# Altium project A3000_8MB.PrjPcb
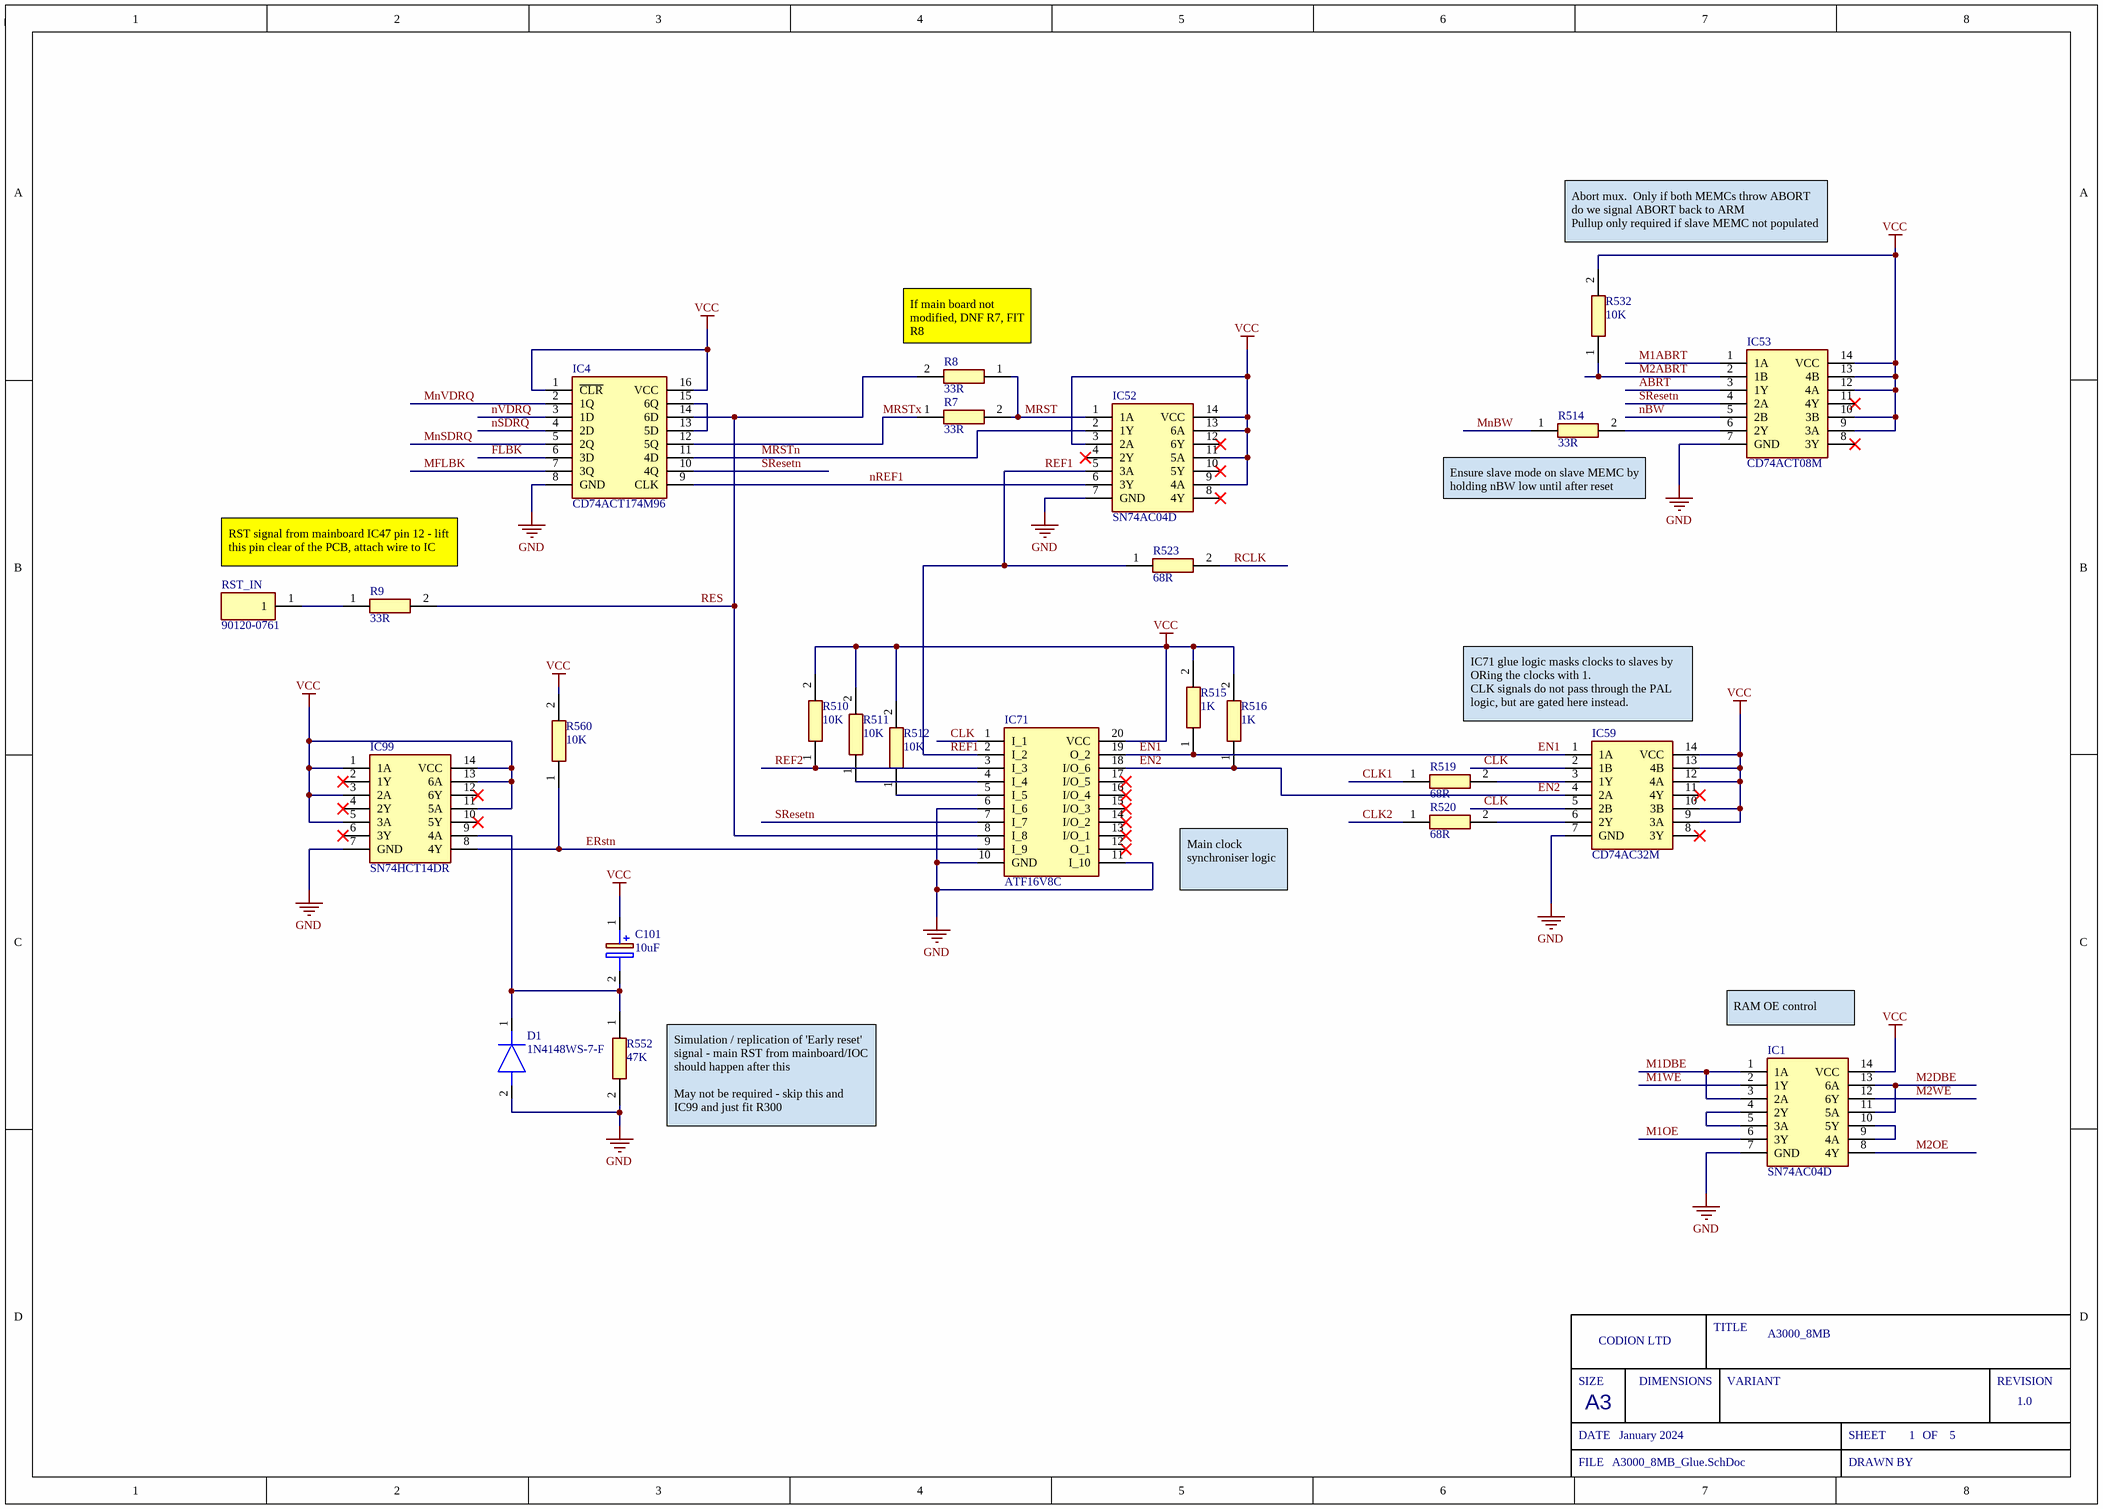
[diagram p0: A3000_8MB_Glue.SchDoc]
BOM_RevNo: 1.0; Engineer_Name: Codion Ltd; PCB_RevNo: 1.2; Project_Title: A3000_8MB; ProjectName: A3000_8MB; Sch_releaseDate: January 2024; Sch_RevNo: 1.0
3 sheets, 83 parts. Net scope: global (net labels, ports and power ports of the same name join across sheets).
Board file: A3000_8MB.pcbdoc
Sheets:
  A3000_8MB_Glue.SchDoc
  A3000_8MB.SchDoc
  A3000_8MB_Slave.SchDoc

## Sheet A3000_8MB_Glue.SchDoc
size A3; DocumentNumber: 1; SheetNumber: 1; SheetTotal: 5

### Parts
C101  10uF  [EEE0GA101SR]
D1  1N4148WS-7-F  [SOD2513X120N]
IC1  SN74AC04D  [SOIC127P600X175-14N]
IC4  CD74ACT174M96  [SOIC127P600X175-16N]
IC52  SN74AC04D  [SOIC127P600X175-14N]
IC53  CD74ACT08M  [SOIC127P600X175-14N]
IC59  CD74AC32M  [SOIC127P600X175-14N]
IC71  ATF16V8C  [DIP762W66P254L2692H508Q20N]
IC99  SN74HCT14DR  [SOIC127P600X175-14N]
R7  33R  [RESC1005X40N]
R8  33R  [RESC1005X40N]
R9  33R  [RESC1005X40N]
R510  10K  [RESC1005X40N]
R511  10K  [RESC1005X40N]
R512  10K  [RESC1005X40N]
R514  33R  [RESC1005X40N]
R515  1K  [RESC1005X40N]
R516  1K  [RESC1005X40N]
R519  68R  [RESC1005X40N]
R520  68R  [RESC1005X40N]
R523  68R  [RESC1005X40N]
R532  10K  [RESC1005X40N]
R552  47K  [RESC1005X40N]
R560  10K  [RESC1005X40N]
RST_IN  90120-0761  [HDRV1W90P0X254_1X1_232X249X560P]

### Nets
GND: D1.2(A) IC1.7(GND) IC4.8(GND) IC52.7(GND) IC53.7(GND) IC59.7(GND) IC71.6(I_6) IC71.10(GND) IC71.11(I_10) IC99.7(GND) R552.2
VCC: C101.1(+) IC1.14(VCC) IC4.1(~{CLR}) IC4.16(VCC) IC52.3(2A) IC52.9(4A) IC52.11(5A) IC52.13(6A) IC52.14(VCC) IC53.9(3A) IC53.10(3B) IC53.12(4A) IC53.13(4B) IC53.14(VCC) IC59.9(3A) IC59.10(3B) IC59.12(4A) IC59.13(4B) IC59.14(VCC) IC71.20(VCC) IC99.1(1A) IC99.3(2A) IC99.5(3A) IC99.11(5A) IC99.13(6A) IC99.14(VCC) R510.2 R511.2 R512.2 R515.2 R516.2 R532.2 R560.2
ABRT: IC53.3(1Y)
CLK: IC59.2(1B) IC59.5(2B) IC71.1(I_1)
CLK1: R519.1
CLK2: R520.1
EN1: IC59.1(1A) IC71.19(O_2) R515.1
EN2: IC59.4(2A) IC71.18(I/O_6) R516.1
ERstn: IC71.9(I_9) IC99.8(4Y) R560.1
FLBK: IC4.6(3D)
M1ABRT: IC53.1(1A)
M1DBE: IC1.1(1A) IC1.3(2A)
M1OE: IC1.6(3Y)
M1WE: IC1.2(1Y)
M2ABRT: IC53.2(1B) R532.1
M2DBE: IC1.11(5A) IC1.13(6A)
M2OE: IC1.8(4Y)
M2WE: IC1.12(6Y)
MFLBK: IC4.7(3Q)
MnBW: R514.1
MnSDRQ: IC4.5(2Q)
MnVDRQ: IC4.2(1Q)
MRST: IC52.1(1A) R7.2 R8.1
MRSTn: IC4.11(4D) IC52.2(1Y)
MRSTx: IC4.12(5Q) R7.1
nBW: IC53.5(2B)
nREF1: IC4.9(CLK) IC52.6(3Y)
nSDRQ: IC4.4(2D)
nVDRQ: IC4.3(1D)
RCLK: R523.2
REF1: IC52.5(3A) IC71.2(I_2) R523.1
REF2: IC71.3(I_3) R510.1
RES: IC4.14(6D) IC71.8(I_8) R8.2 R9.2
SResetn: IC4.10(4Q) IC53.4(2A) IC71.7(I_7)
NetC101_2: C101.2(-) D1.1(K) IC99.9(4A) R552.1
NetIC1_4: IC1.4(2Y) IC1.5(3A)
NetIC1_9: IC1.9(4A) IC1.10(5Y)
NetIC4_13: IC4.13(5D) IC4.15(6Q)
NetIC53_6: IC53.6(2Y) R514.2
NetIC59_3: IC59.3(1Y) R519.2
NetIC59_6: IC59.6(2Y) R520.2
NetIC71_4: IC71.4(I_4) R511.1
NetIC71_5: IC71.5(I_5) R512.1
NetR9_1: R9.1 RST_IN.1

Not connected (* = marked no-connect by the designer): IC52 4(2Y)* 8(4Y)* 10(5Y)* 12(6Y)*; IC53 8(3Y)* 11(4Y)*; IC59 8(3Y)* 11(4Y)*; IC71 12(O_1)* 13(I/O_1)* 14(I/O_2)* 15(I/O_3)* 16(I/O_4)* 17(I/O_5)*; IC99 2(1Y)* 4(2Y)* 6(3Y)* 10(5Y)* 12(6Y)*

### Notes on the sheet
- Abort mux.  Only if both MEMCs throw ABORT do we signal ABORT back to ARM
  Pullup only required if slave MEMC not populated
- (near R8) If main board not modified, DNF R7, FIT R8
- (near R514) Ensure slave mode on slave MEMC by holding nBW low until after reset
- RST signal from mainboard IC47 pin 12 - lift this pin clear of the PCB, attach wire to IC
- (near IC59) IC71 glue logic masks clocks to slaves by ORing the clocks with 1.
  CLK signals do not pass through the PAL logic, but are gated here instead.
- Main clock synchroniser logic
- (near IC1) RAM OE control
- Simulation / replication of 'Early reset' signal - main RST from mainboard/IOC should happen after this
  May not be required - skip this and IC99 and just fit R300
- SIZE
- CODION LTD
- DIMENSIONS
- TITLE
- VARIANT
- REVISION
- DATE
- A3
- SHEET
- OF
- FILE
- DRAWN BY

### Library data of the parts
C101 = EEE-1EA100SR: Capacitor Polarised; Manufacturer_Name: Panasonic; Datasheet Link: http://industrial.panasonic.com/cdbs/www-data/pdf/RDE0000/ABA0000C1145.pdf; Height: 6.5mm; Manufacturer_Part_Number: EEE-1EA100SR; Mouser Part Number: 667-EEE-1EA100SR; Mouser Price/Stock: https://www.mouser.co.uk/ProductDetail/Panasonic/EEE-1EA100SR?qs=ANJC8C65Mw4%2Fvo1GoepKcQ%3D%3D; Arrow Part Number: EEE-1EA100SR; Arrow Price/Stock: https://www.arrow.com/en/products/eee-1ea100sr/panasonic?region=nac
D1 = 1N4148WS-7-F: Diode; Manufacturer_Name: Diodes Inc.; Datasheet Link: https://componentsearchengine.com/Datasheets/2/1N4148WS-7-F.pdf; Height: 1.2mm; Manufacturer_Part_Number: 1N4148WS-7-F; Mouser Part Number: 621-1N4148WS-F; Mouser Price/Stock: https://www.mouser.co.uk/ProductDetail/Diodes-Incorporated/1N4148WS-7-F?qs=4drIV0IxA0r8aNy7%2Fu4kVw%3D%3D; Arrow Part Number: 1N4148WS-7-F; Arrow Price/Stock: https://www.arrow.com/en/products/1n4148ws-7-f/diodes-incorporated?region=asia; LCSC Part #: C2128
IC1 IC52 = SN74AC04D: Integrated Circuit; Manufacturer_Name: Texas Instruments; Datasheet Link: http://www.ti.com/lit/ds/symlink/sn74ac04.pdf; Height: 1.75mm; Manufacturer_Part_Number: SN74AC04D; Mouser Part Number: 595-SN74AC04D; Mouser Price/Stock: https://www.mouser.co.uk/ProductDetail/Texas-Instruments/SN74AC04D?qs=w32V8uFkMxkvsyMHHacuZw%3D%3D; Arrow Part Number: SN74AC04D; Arrow Price/Stock: https://www.arrow.com/en/products/sn74ac04d/texas-instruments?region=nac; LCSC Part #: C352940
IC4 = CD74ACT174M96: Integrated Circuit; Manufacturer_Name: Texas Instruments; Datasheet Link: http://www.ti.com/lit/gpn/cd74act174; Height: 1.75mm; Manufacturer_Part_Number: CD74ACT174M96; Mouser Part Number: 595-CD74ACT174M96; Mouser Price/Stock: https://www.mouser.co.uk/ProductDetail/Texas-Instruments/CD74ACT174M96?qs=w32V8uFkMxkDXs1ka6HDkg%3D%3D
IC53 = CD74ACT08M: Integrated Circuit; Manufacturer_Name: Texas Instruments; Datasheet Link: http://www.ti.com/lit/ds/symlink/cd74act08.pdf; Height: 1.75mm; Manufacturer_Part_Number: CD74ACT08M; Mouser Part Number: 595-CD74ACT08M; Mouser Price/Stock: https://www.mouser.co.uk/ProductDetail/Texas-Instruments/CD74ACT08M?qs=Dqy2GfToSoQdsNWXM2phYA%3D%3D; LCSC Part #: C233452
IC59 = CD74AC32M: Integrated Circuit; Manufacturer_Name: Texas Instruments; Datasheet Link: http://www.ti.com/lit/ds/symlink/cd74ac32.pdf; Height: 1.75mm; Manufacturer_Part_Number: CD74AC32M; Mouser Part Number: 595-CD74AC32M; Mouser Price/Stock: https://www.mouser.co.uk/ProductDetail/Texas-Instruments/CD74AC32M?qs=OorDGPQ79Eqsy7tzrsTtUg%3D%3D; Arrow Part Number: CD74AC32M; Arrow Price/Stock: https://www.arrow.com/en/products/cd74ac32m/texas-instruments; LCSC Part #: C352943
IC71 = PAL16R4AMJ: Integrated Circuit; Manufacturer_Name: Texas Instruments; Datasheet Link: http://www.ti.com/lit/ds/symlink/pal16r4am.pdf; Height: 5.08mm; Manufacturer_Part_Number: PAL16R4AMJ; Mouser Part Number: 595-PAL16R4AMJ; Mouser Price/Stock: https://www.mouser.com/Search/Refine.aspx?Keyword=595-PAL16R4AMJ
IC99 = SN74HCT14DR: Integrated Circuit; Manufacturer_Name: Texas Instruments; Datasheet Link: http://www.ti.com/lit/ds/symlink/sn74hct14.pdf; Height: 1.75mm; Manufacturer_Part_Number: SN74HCT14DR; Mouser Part Number: 595-SN74HCT14DR; Mouser Price/Stock: https://www.mouser.co.uk/ProductDetail/Texas-Instruments/SN74HCT14DR?qs=SL3LIuy2dWxogEVGE105Iw%3D%3D; Arrow Part Number: SN74HCT14DR; Arrow Price/Stock: https://www.arrow.com/en/products/sn74hct14dr/texas-instruments?region=nac; LCSC Part #: C6769
R7-R9 R514 = CRCW040233R0FKED: Resistor; Manufacturer_Name: Vishay; Datasheet Link: http://www.vishay.com/docs/20035/dcrcwe3.pdf; Height: 0.4mm; Manufacturer_Part_Number: CRCW040233R0FKED; Mouser Part Number: 71-CRCW0402-33-E3; Mouser Price/Stock: https://www.mouser.co.uk/ProductDetail/Vishay-Dale/CRCW040233R0FKED?qs=TNtMkGKFKOyo77UGFlXIJw%3D%3D; Arrow Part Number: CRCW040233R0FKED; Arrow Price/Stock: https://www.arrow.com/en/products/crcw040233r0fked/vishay; LCSC Part #: C137880
R510-R512 R532 R560 = CRCW040210K0FKEDHP: Resistor; Manufacturer_Name: Vishay; Datasheet Link: http://www.vishay.com/docs/20035/dcrcwe3.pdf; Height: 0.4mm; Manufacturer_Part_Number: CRCW040210K0FKEDHP; Mouser Part Number: 71-CRCW040210K0FKEDH; Mouser Price/Stock: https://www.mouser.co.uk/ProductDetail/Vishay-Dale/CRCW040210K0FKEDHP?qs=FlFvgi4rxBxmIiaeyFjrkA%3D%3D; Arrow Part Number: CRCW040210K0FKEDHP; Arrow Price/Stock: https://www.arrow.com/en/products/crcw040210k0fkedhp/vishay?region=nac; LCSC Part #: C71617
R515 R516 = CRCW04021K00JNED: Resistor; Manufacturer_Name: Vishay; Datasheet Link: http://www.vishay.com/docs/20035/dcrcwe3.pdf; Height: 0.4mm; Manufacturer_Part_Number: CRCW04021K00JNED; Mouser Part Number: 71-CRCW0402J-1.0K-E3; Mouser Price/Stock: https://www.mouser.co.uk/ProductDetail/Vishay-Dale/CRCW04021K00JNED?qs=YX%252BK5oaHNYpGRsHVuzxl1A%3D%3D; Arrow Part Number: CRCW04021K00JNED; Arrow Price/Stock: https://www.arrow.com/en/products/crcw04021k00jned/vishay; LCSC Part #: C279981
R519 R520 R523 = CRCW040268R0FKEDHP: Resistor; Manufacturer_Name: Vishay; Datasheet Link: http://www.vishay.com/docs/20035/dcrcwe3.pdf; Height: 0.4mm; Manufacturer_Part_Number: CRCW040268R0FKEDHP; Mouser Part Number: 71-CRCW040268R0FKEDH; Mouser Price/Stock: https://www.mouser.co.uk/ProductDetail/Vishay-Dale/CRCW040268R0FKEDHP?qs=YaA%252B3EhhSt26vU44iyW%252BOw%3D%3D; Arrow Part Number: CRCW040268R0FKEDHP; Arrow Price/Stock: https://www.arrow.com/en/products/crcw040268r0fkedhp/vishay; LCSC Part #: C163455
R552 = CRCW040247K0FKED: Resistor; Manufacturer_Name: Vishay; Datasheet Link: http://www.vishay.com/docs/20035/dcrcwe3.pdf; Height: 0.4mm; Manufacturer_Part_Number: CRCW040247K0FKED; Mouser Part Number: 71-CRCW0402-47K-E3; Mouser Price/Stock: https://www.mouser.co.uk/ProductDetail/Vishay-Dale/CRCW040247K0FKED?qs=rzhQWu8UUS0SPbmGf0DOIg%3D%3D; Arrow Part Number: CRCW040247K0FKED; Arrow Price/Stock: https://www.arrow.com/en/products/crcw040247k0fked/vishay; LCSC Part #: C163440
RST_IN = 90120-0761: Connector; Manufacturer_Name: Molex; Datasheet Link: https://www.molex.com/pdm_docs/sd/901200761_sd.pdf; Height: 5.6mm; Manufacturer_Part_Number: 90120-0761; Mouser Part Number: 538-90120-0761; Mouser Price/Stock: https://www.mouser.co.uk/ProductDetail/Molex/90120-0761?qs=PvP5v7Eimsn%2F58TpDaAAow%3D%3D

## Sheet A3000_8MB.SchDoc: ARM2 to ARM3 Adapter
size A3; DocumentNumber: 1; SheetNumber: 2; SheetTotal: 5
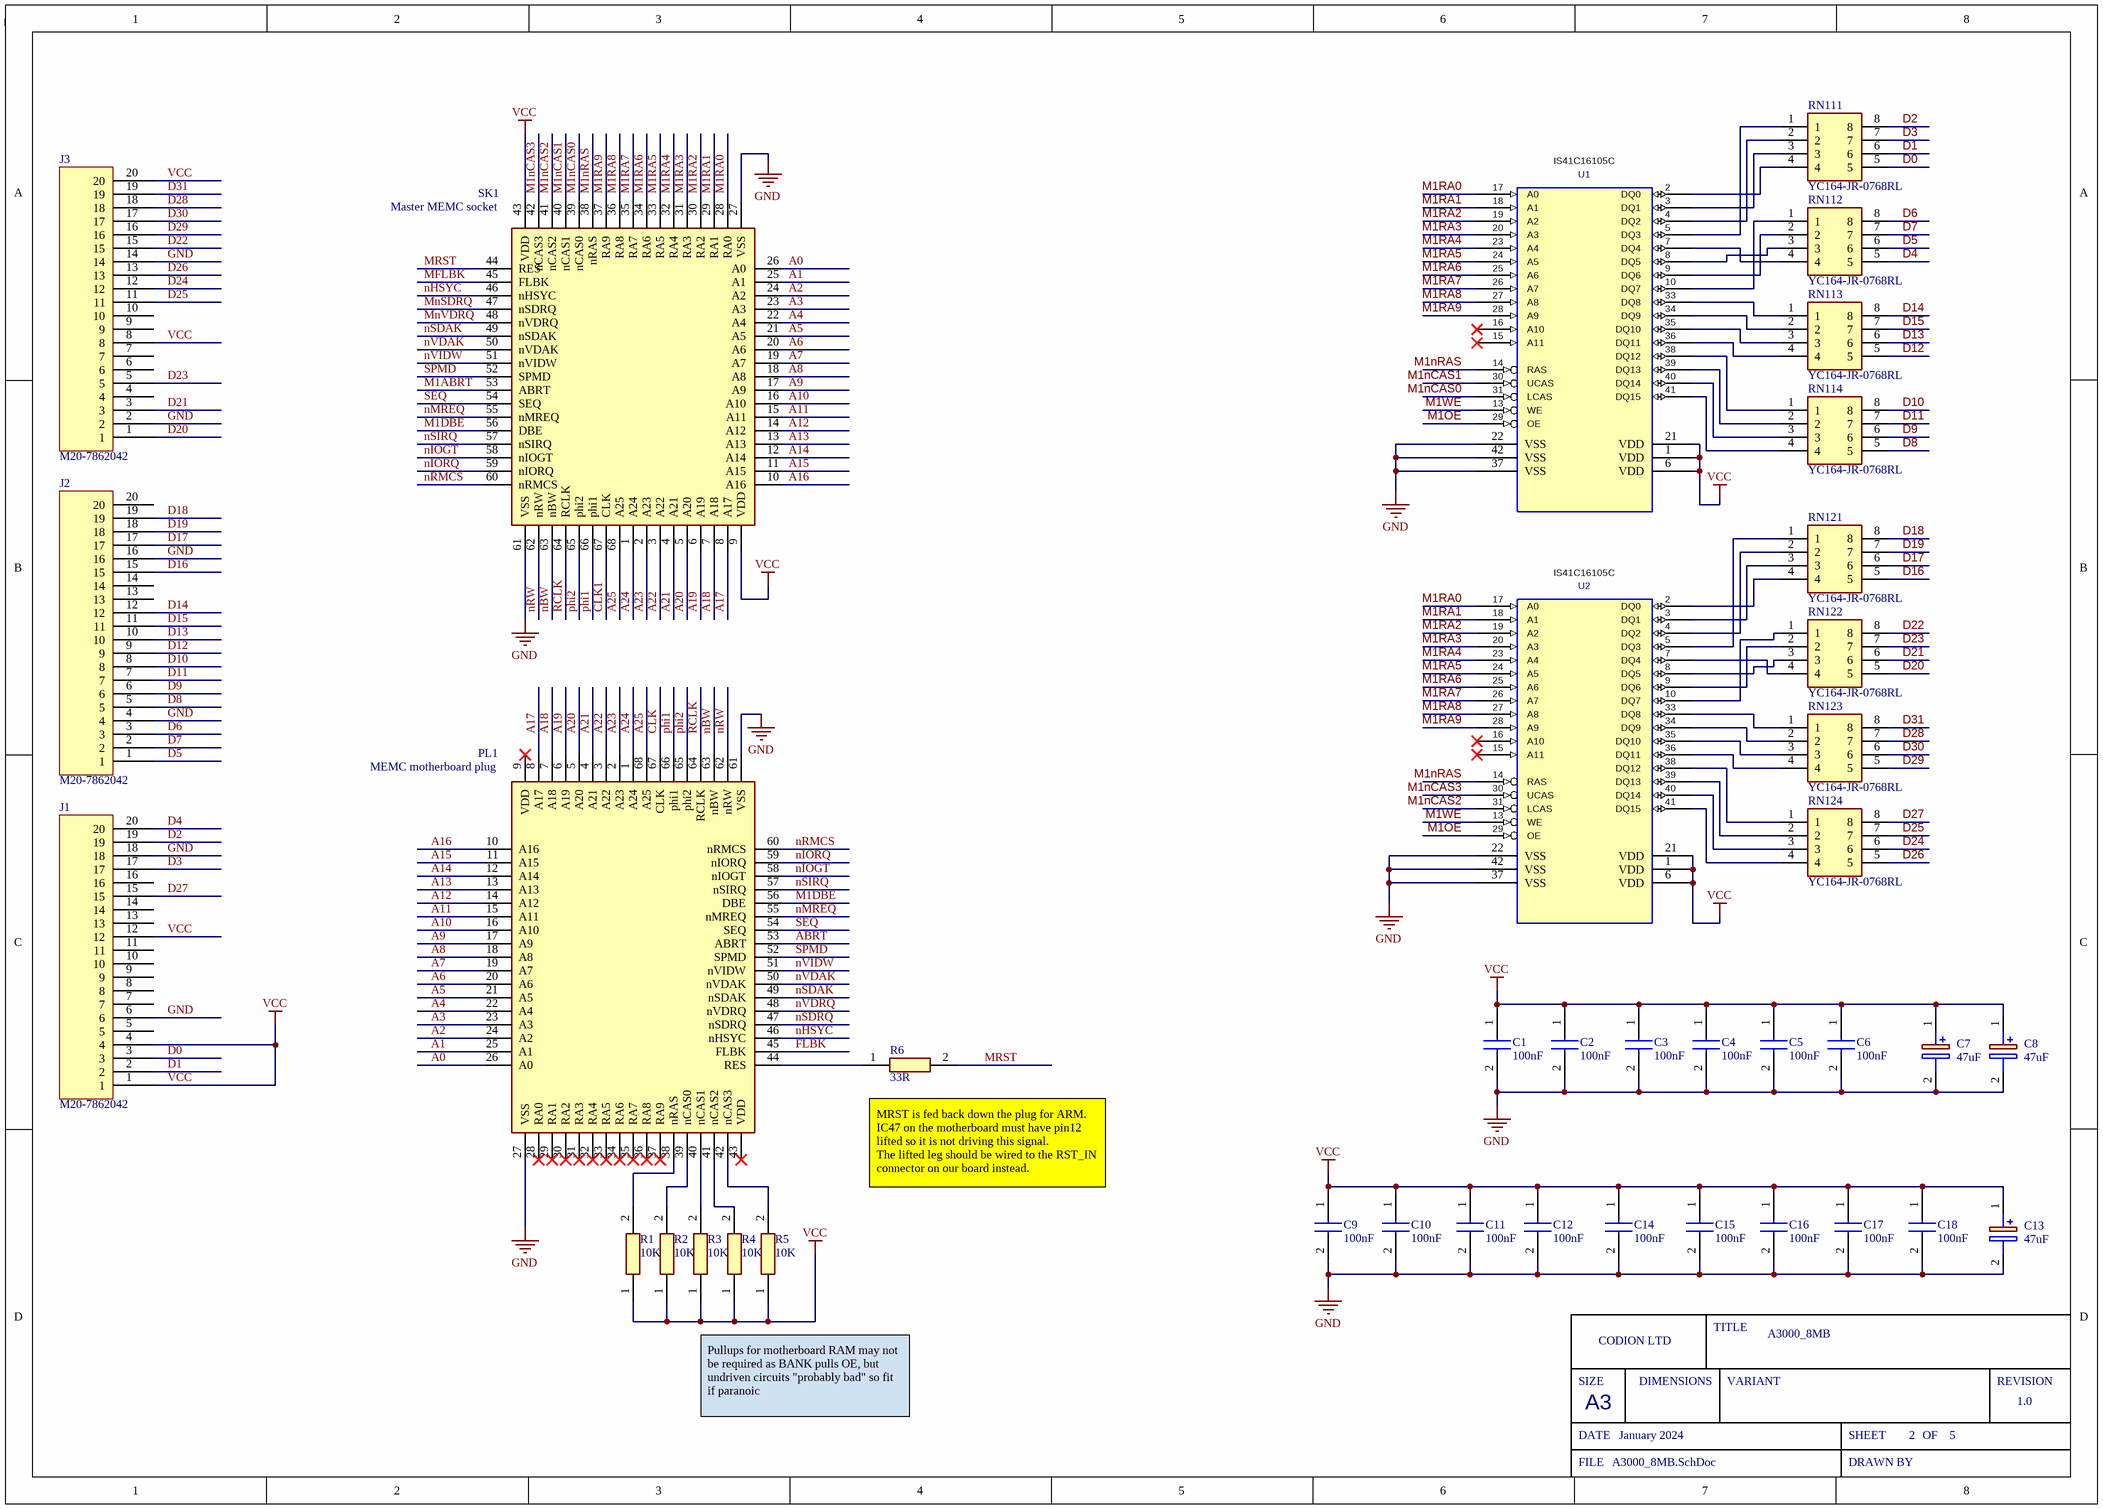
[diagram p1: A3000_8MB.SchDoc]

### Parts
C1  100nF  [0805cap]
C2  100nF  [0805cap]
C3  100nF  [0805cap]
C4  100nF  [0805cap]
C5  100nF  [0805cap]
C6  100nF  [0805cap]
C7  47uF  [EEE1AA101SP]
C8  47uF  [EEE1AA101SP]
C9  100nF  [0805cap]
C10  100nF  [0805cap]
C11  100nF  [0805cap]
C12  100nF  [0805cap]
C13  47uF  [EEE1AA101SP]
C14  100nF  [0805cap]
C15  100nF  [0805cap]
C16  100nF  [0805cap]
C17  100nF  [0805cap]
C18  100nF  [0805cap]
J1  M20-7862042  [M207862042]
J2  M20-7862042  [M207862042]
J3  M20-7862042  [M207862042]
PL1  MEMC motherboard plug  [MEMC_Plug]
R1  10K  [RESC1005X40N]
R2  10K  [RESC1005X40N]
R3  10K  [RESC1005X40N]
R4  10K  [RESC1005X40N]
R5  10K  [RESC1005X40N]
R6  33R  [RESC1005X40N]
RN111  YC164-JR-0768RL  [YC164JR0768RL]
RN112  YC164-JR-0768RL  [YC164JR0768RL]
RN113  YC164-JR-0768RL  [YC164JR0768RL]
RN114  YC164-JR-0768RL  [YC164JR0768RL]
RN121  YC164-JR-0768RL  [YC164JR0768RL]
RN122  YC164-JR-0768RL  [YC164JR0768RL]
RN123  YC164-JR-0768RL  [YC164JR0768RL]
RN124  YC164-JR-0768RL  [YC164JR0768RL]
SK1  Master MEMC socket  [MEMC_Socket]
U1  IS41C16105C  [SOJ-42]
U2  IS41C16105C  [SOJ-42]

### Nets
GND: C1.2 C2.2 C3.2 C4.2 C5.2 C6.2 C7.2(-) C8.2(-) C9.2 C10.2 C11.2 C12.2 C13.2(-) C14.2 C15.2 C16.2 C17.2 C18.2 J1.6 J1.18 J2.4 J2.16 J3.2 J3.14 PL1.27(VSS) PL1.61(VSS) SK1.27(VSS) SK1.61(VSS) U1.22(VSS) U1.37(VSS) U1.42(VSS) U2.22(VSS) U2.37(VSS) U2.42(VSS)
VCC: C1.1 C2.1 C3.1 C4.1 C5.1 C6.1 C7.1(+) C8.1(+) C9.1 C10.1 C11.1 C12.1 C13.1(+) C14.1 C15.1 C16.1 C17.1 C18.1 J1.1 J1.4 J1.12 J3.8 J3.20 R1.1 R2.1 R3.1 R4.1 R5.1 SK1.9(VDD) SK1.43(VDD) U1.1(VCC) U1.6(VCC) U1.21(VCC) U2.1(VCC) U2.6(VCC) U2.21(VCC)
A0: PL1.26(A0) SK1.26(A0)
A1: PL1.25(A1) SK1.25(A1)
A2: PL1.24(A2) SK1.24(A2)
A3: PL1.23(A3) SK1.23(A3)
A4: PL1.22(A4) SK1.22(A4)
A5: PL1.21(A5) SK1.21(A5)
A6: PL1.20(A6) SK1.20(A6)
A7: PL1.19(A7) SK1.19(A7)
A8: PL1.18(A8) SK1.18(A8)
A9: PL1.17(A9) SK1.17(A9)
A10: PL1.16(A10) SK1.16(A10)
A11: PL1.15(A11) SK1.15(A11)
A12: PL1.14(A12) SK1.14(A12)
A13: PL1.13(A13) SK1.13(A13)
A14: PL1.12(A14) SK1.12(A14)
A15: PL1.11(A15) SK1.11(A15)
A16: PL1.10(A16) SK1.10(A16)
A17: PL1.8(A17) SK1.8(A17)
A18: PL1.7(A18) SK1.7(A18)
A19: PL1.6(A19) SK1.6(A19)
A20: PL1.5(A20) SK1.5(A20)
A21: PL1.4(A21) SK1.4(A21)
A22: PL1.3(A22) SK1.3(A22)
A23: PL1.2(A23) SK1.2(A23)
A24: PL1.1(A24) SK1.1(A24)
A25: PL1.68(A25) SK1.68(A25)
ABRT: PL1.53(ABRT)
CLK: PL1.67(CLK)
CLK1: SK1.67(CLK)
D0: J1.3 RN111.5
D1: J1.2 RN111.6
D2: J1.19 RN111.8
D3: J1.17 RN111.7
D4: J1.20 RN112.5
D5: J2.1 RN112.6
D6: J2.3 RN112.8
D7: J2.2 RN112.7
D8: J2.5 RN114.5
D9: J2.6 RN114.6
D10: J2.8 RN114.8
D11: J2.7 RN114.7
D12: J2.9 RN113.5
D13: J2.10 RN113.6
D14: J2.12 RN113.8
D15: J2.11 RN113.7
D16: J2.15 RN121.5
D17: J2.17 RN121.6
D18: J2.19 RN121.8
D19: J2.18 RN121.7
D20: J3.1 RN122.5
D21: J3.3 RN122.6
D22: J3.15 RN122.8
D23: J3.5 RN122.7
D24: J3.12 RN124.6
D25: J3.11 RN124.7
D26: J3.13 RN124.5
D27: J1.15 RN124.8
D28: J3.18 RN123.7
D29: J3.16 RN123.5
D30: J3.17 RN123.6
D31: J3.19 RN123.8
FLBK: PL1.45(FLBK)
M1ABRT: SK1.53(ABRT)
M1DBE: PL1.56(DBE) SK1.56(DBE)
M1nCAS0: SK1.39(nCAS0) U1.31(LCAS)
M1nCAS1: SK1.40(nCAS1) U1.30(UCAS)
M1nCAS2: SK1.41(nCAS2) U2.31(LCAS)
M1nCAS3: SK1.42(nCAS3) U2.30(UCAS)
M1nRAS: SK1.38(nRAS) U1.14(RAS) U2.14(RAS)
M1OE: U1.29(OE) U2.29(OE)
M1RA0: SK1.28(RA0) U1.17(A0) U2.17(A0)
M1RA1: SK1.29(RA1) U1.18(A1) U2.18(A1)
M1RA2: SK1.30(RA2) U1.19(A2) U2.19(A2)
M1RA3: SK1.31(RA3) U1.20(A3) U2.20(A3)
M1RA4: SK1.32(RA4) U1.23(A4) U2.23(A4)
M1RA5: SK1.33(RA5) U1.24(A5) U2.24(A5)
M1RA6: SK1.34(RA6) U1.25(A6) U2.25(A6)
M1RA7: SK1.35(RA7) U1.26(A7) U2.26(A7)
M1RA8: SK1.36(RA8) U1.27(A8) U2.27(A8)
M1RA9: SK1.37(RA9) U1.28(A9) U2.28(A9)
M1WE: U1.13(WE) U2.13(WE)
MFLBK: SK1.45(FLBK)
MnSDRQ: SK1.47(nSDRQ)
MnVDRQ: SK1.48(nVDRQ)
MRST: R6.2 SK1.44(RES)
nBW: PL1.63(nBW) SK1.63(nBW)
nHSYC: PL1.46(nHSYC) SK1.46(nHSYC)
nIOGT: PL1.58(nIOGT) SK1.58(nIOGT)
nIORQ: PL1.59(nIORQ) SK1.59(nIORQ)
nMREQ: PL1.55(nMREQ) SK1.55(nMREQ)
nRMCS: PL1.60(nRMCS) SK1.60(nRMCS)
nRW: PL1.62(nRW) SK1.62(nRW)
nSDAK: PL1.49(nSDAK) SK1.49(nSDAK)
nSDRQ: PL1.47(nSDRQ)
nSIRQ: PL1.57(nSIRQ) SK1.57(nSIRQ)
nVDAK: PL1.50(nVDAK) SK1.50(nVDAK)
nVDRQ: PL1.48(nVDRQ)
nVIDW: PL1.51(nVIDW) SK1.51(nVIDW)
phi1: PL1.66(phi1) SK1.66(phi1)
phi2: PL1.65(phi2) SK1.65(phi2)
RCLK: PL1.64(RCLK) SK1.64(RCLK)
SEQ: PL1.54(SEQ) SK1.54(SEQ)
SPMD: PL1.52(SPMD) SK1.52(SPMD)
NetPL1_38: PL1.38(nRAS) R1.2
NetPL1_39: PL1.39(nCAS0) R2.2
NetPL1_40: PL1.40(nCAS1) R3.2
NetPL1_41: PL1.41(nCAS2) R4.2
NetPL1_42: PL1.42(nCAS3) R5.2
NetPL1_44: PL1.44(RES) R6.1
NetRN111_1: RN111.1 U1.5(DQ3)
NetRN111_2: RN111.2 U1.4(DQ2)
NetRN111_3: RN111.3 U1.3(DQ1)
NetRN111_4: RN111.4 U1.2(DQ0)
NetRN112_1: RN112.1 U1.10(DQ7)
NetRN112_2: RN112.2 U1.9(DQ6)
NetRN112_3: RN112.3 U1.8(DQ5)
NetRN112_4: RN112.4 U1.7(DQ4)
NetRN113_1: RN113.1 U1.33(DQ8)
NetRN113_2: RN113.2 U1.34(DQ9)
NetRN113_3: RN113.3 U1.35(DQ10)
NetRN113_4: RN113.4 U1.36(DQ11)
NetRN114_1: RN114.1 U1.38(DQ12)
NetRN114_2: RN114.2 U1.39(DQ13)
NetRN114_3: RN114.3 U1.40(DQ14)
NetRN114_4: RN114.4 U1.41(DQ15)
NetRN121_1: RN121.1 U2.5(DQ3)
NetRN121_2: RN121.2 U2.4(DQ2)
NetRN121_3: RN121.3 U2.3(DQ1)
NetRN121_4: RN121.4 U2.2(DQ0)
NetRN122_1: RN122.1 U2.10(DQ7)
NetRN122_2: RN122.2 U2.9(DQ6)
NetRN122_3: RN122.3 U2.8(DQ5)
NetRN122_4: RN122.4 U2.7(DQ4)
NetRN123_1: RN123.1 U2.33(DQ8)
NetRN123_2: RN123.2 U2.34(DQ9)
NetRN123_3: RN123.3 U2.35(DQ10)
NetRN123_4: RN123.4 U2.36(DQ11)
NetRN124_1: RN124.1 U2.38(DQ12)
NetRN124_2: RN124.2 U2.39(DQ13)
NetRN124_3: RN124.3 U2.40(DQ14)
NetRN124_4: RN124.4 U2.41(DQ15)

Not connected (* = marked no-connect by the designer): J1 5 7 8 9 10 11 13 14 16; J2 13 14 20; J3 4 6 7 9 10; PL1 9(VDD)* 28(RA0)* 29(RA1)* 30(RA2)* 31(RA3)* 32(RA4)* 33(RA5)* 34(RA6)* 35(RA7)* 36(RA8)* 37(RA9)* 43(VDD)*; U1 15(A11)* 16(A10)*; U2 15(A11)* 16(A10)*

### Notes on the sheet
- (near R6) MRST is fed back down the plug for ARM.
  IC47 on the motherboard must have pin12 lifted so it is not driving this signal.
  The lifted leg should be wired to the RST_IN connector on our board instead.
- Pullups for motherboard RAM may not be required as BANK pulls OE, but undriven circuits "probably bad" so fit if paranoic
- SIZE
- CODION LTD
- DIMENSIONS
- TITLE
- VARIANT
- REVISION
- DATE
- A3
- SHEET
- OF
- FILE
- DRAWN BY

### Library data of the parts
C1-C6 C9-C12 C14-C18 = 100nF0805: Capacitor; Manufacturer_Name: TDK; Manufacturer_Part_Number: C2012X7R1H104K125AM; Datasheet Link: https://product.tdk.com/info/en/catalog/datasheets/mlcc_commercial_midvoltage_en.pdf; Height: 1.45mm; Mouser Part Number: 810-C2012X7R1H104KT5; Mouser Price/Stock: https://www.mouser.com/Search/Refine.aspx?Keyword=810-C2012X7R1H104KT5; Arrow Part Number: C2012X7R1H104K125AM; Arrow Price/Stock: https://www.arrow.com/en/products/c2012x7r1h104k125am/tdk; LCSC Part #: C111492
C7 C8 C13 = EEE1VA470WP: Capacitor Polarised; Manufacturer_Name: Panasonic; Datasheet Link: http://industrial.panasonic.com/cdbs/www-data/pdf/RDE0000/ABA0000C1145.pdf; Height: 7.8mm; Manufacturer_Part_Number: EEE1VA470WP
J1-J3 = M20-7862042: Connector; Manufacturer_Name: Harwin; Description: 2.54mm (0.1") Pitch SIL SMT Dual Entry Socket Assembly; Datasheet Link: https://cdn.harwin.com/pdfs/M20-786.pdf; Height: 8mm; Manufacturer_Part_Number: M20-7862042; Mouser Part Number: 855-M20-7862042; Mouser Price/Stock: https://www.mouser.co.uk/ProductDetail/Harwin/M20-7862042?qs=l5IOXVh7iozhFLf%252B9355XQ%3D%3D
PL1 = MEMC_Plug: MEMC plug
R1-R5 = CRCW040210K0FKEDHP: Resistor; Manufacturer_Name: Vishay; Datasheet Link: http://www.vishay.com/docs/20035/dcrcwe3.pdf; Height: 0.4mm; Manufacturer_Part_Number: CRCW040210K0FKEDHP; Mouser Part Number: 71-CRCW040210K0FKEDH; Mouser Price/Stock: https://www.mouser.co.uk/ProductDetail/Vishay-Dale/CRCW040210K0FKEDHP?qs=FlFvgi4rxBxmIiaeyFjrkA%3D%3D; Arrow Part Number: CRCW040210K0FKEDHP; Arrow Price/Stock: https://www.arrow.com/en/products/crcw040210k0fkedhp/vishay?region=nac; LCSC Part #: C71617
R6 = CRCW040233R0FKED: Resistor; Manufacturer_Name: Vishay; Datasheet Link: http://www.vishay.com/docs/20035/dcrcwe3.pdf; Height: 0.4mm; Manufacturer_Part_Number: CRCW040233R0FKED; Mouser Part Number: 71-CRCW0402-33-E3; Mouser Price/Stock: https://www.mouser.co.uk/ProductDetail/Vishay-Dale/CRCW040233R0FKED?qs=TNtMkGKFKOyo77UGFlXIJw%3D%3D; Arrow Part Number: CRCW040233R0FKED; Arrow Price/Stock: https://www.arrow.com/en/products/crcw040233r0fked/vishay; LCSC Part #: C137880
RN111-RN114 RN121-RN124 = YC164-JR-0768RL: Resistor Network; Manufacturer_Name: KEMET; Datasheet Link: https://www.yageo.com/upload/media/product/productsearch/datasheet/rchip/PYu-YC_TC_group_51_RoHS_L_9.pdf; Height: 0.7mm; Manufacturer_Part_Number: YC164-JR-0768RL; Mouser Part Number: 603-YC164-JR-0768RL; Mouser Price/Stock: https://www.mouser.co.uk/ProductDetail/Yageo/YC164-JR-0768RL?qs=8cPjvKtxWv7AOp%2F0jDxI3w%3D%3D; Arrow Part Number: YC164-JR-0768RL; Arrow Price/Stock: https://www.arrow.com/en/products/yc164-jr-0768rl/yageo; LCSC Part #: C695188
SK1 = MEMC_Skt: MEMC socket; Manufacturer_Name: 3M; Manufacturer_Part_Number: 8468-21B1-RK-TR; Datasheet Link: https://www.arrow.com/en/products/8468-21b1-rk-tr/3m; Height: 4.6mm; Mouser Part Number: 517-8468-21B1-RK-TR; Mouser Price/Stock: https://www.mouser.co.uk/ProductDetail/3M-Electronic-Solutions-Division/8468-21B1-RK-TR?qs=X%2F%2F06fXhnJ18zOj3KK47CQ%3D%3D; Arrow Part Number: 8468-21B1-RK-TR; Arrow Price/Stock: https://www.arrow.com/en/products/8468-21b1-rk-tr/3m
U1 U2 = DRAM_1MX16_SOJ: Value: IS41C16105C

## Sheet A3000_8MB_Slave.SchDoc: ARM2 to ARM3 Adapter
size A3; DocumentNumber: 1; SheetNumber: 3; SheetTotal: 5
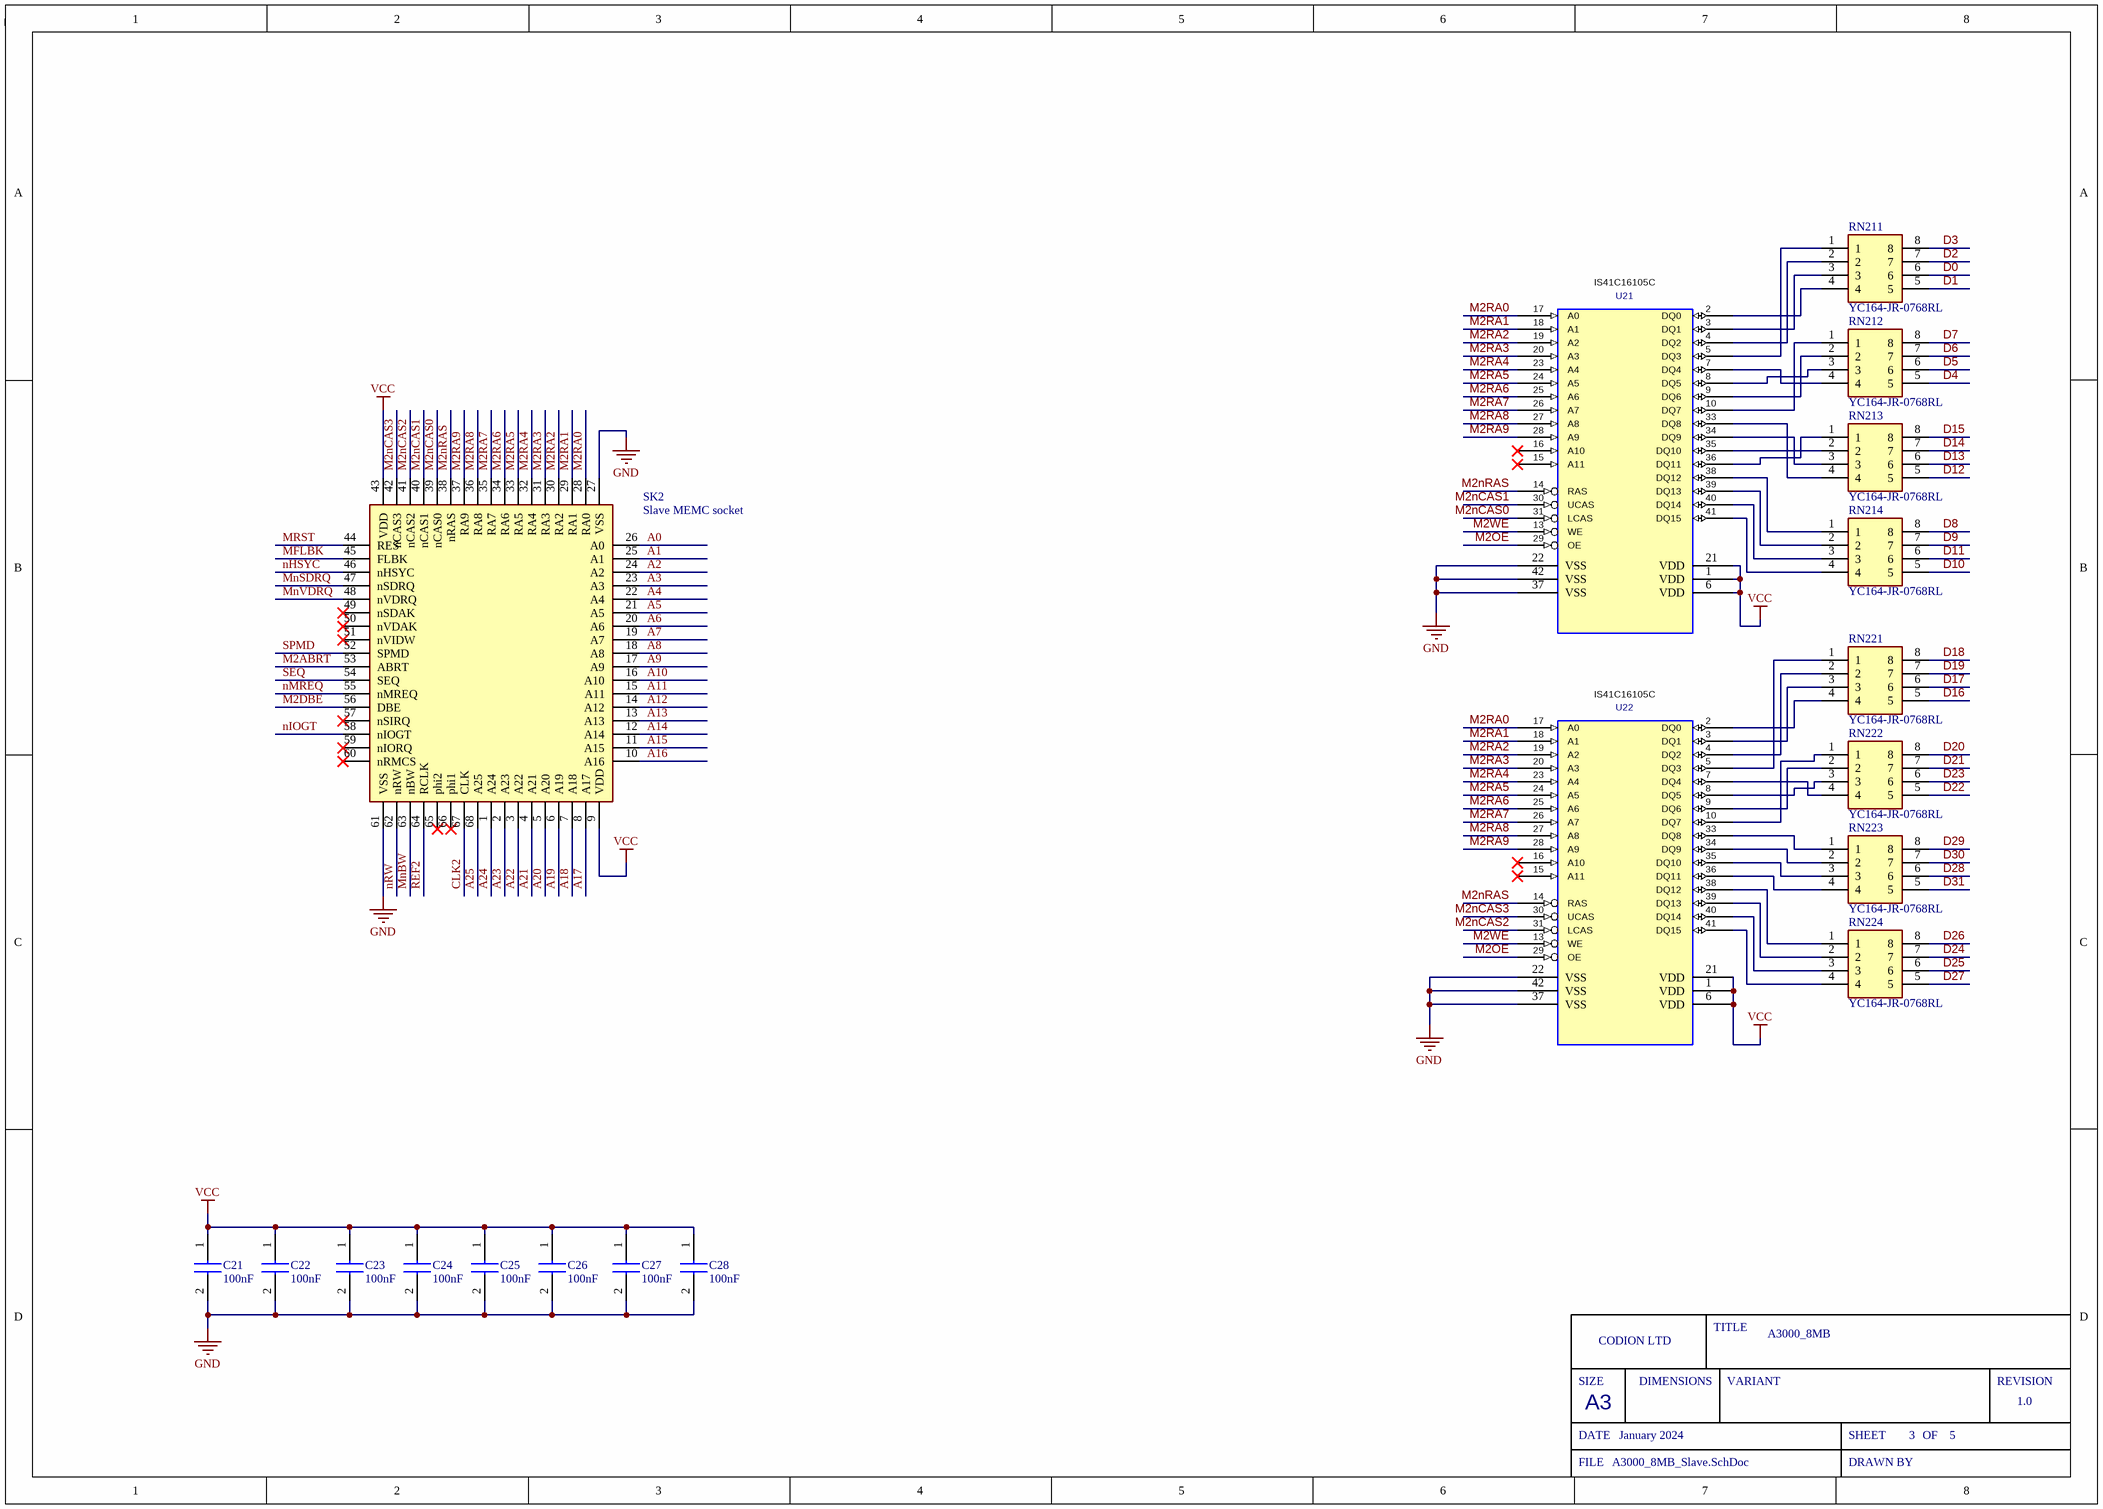
[diagram p2: A3000_8MB_Slave.SchDoc]

### Parts
C21  100nF  [0805cap]
C22  100nF  [0805cap]
C23  100nF  [0805cap]
C24  100nF  [0805cap]
C25  100nF  [0805cap]
C26  100nF  [0805cap]
C27  100nF  [0805cap]
C28  100nF  [0805cap]
RN211  YC164-JR-0768RL  [YC164JR0768RL]
RN212  YC164-JR-0768RL  [YC164JR0768RL]
RN213  YC164-JR-0768RL  [YC164JR0768RL]
RN214  YC164-JR-0768RL  [YC164JR0768RL]
RN221  YC164-JR-0768RL  [YC164JR0768RL]
RN222  YC164-JR-0768RL  [YC164JR0768RL]
RN223  YC164-JR-0768RL  [YC164JR0768RL]
RN224  YC164-JR-0768RL  [YC164JR0768RL]
SK2  Slave MEMC socket  [MEMC_Socket]
U21  IS41C16105C  [SOJ-42]
U22  IS41C16105C  [SOJ-42]

### Nets
GND: C21.2 C22.2 C23.2 C24.2 C25.2 C26.2 C27.2 C28.2 SK2.27(VSS) SK2.61(VSS) U21.22(VSS) U21.37(VSS) U21.42(VSS) U22.22(VSS) U22.37(VSS) U22.42(VSS)
VCC: C21.1 C22.1 C23.1 C24.1 C25.1 C26.1 C27.1 C28.1 SK2.9(VDD) SK2.43(VDD) U21.1(VCC) U21.6(VCC) U21.21(VCC) U22.1(VCC) U22.6(VCC) U22.21(VCC)
A0: SK2.26(A0)
A1: SK2.25(A1)
A2: SK2.24(A2)
A3: SK2.23(A3)
A4: SK2.22(A4)
A5: SK2.21(A5)
A6: SK2.20(A6)
A7: SK2.19(A7)
A8: SK2.18(A8)
A9: SK2.17(A9)
A10: SK2.16(A10)
A11: SK2.15(A11)
A12: SK2.14(A12)
A13: SK2.13(A13)
A14: SK2.12(A14)
A15: SK2.11(A15)
A16: SK2.10(A16)
A17: SK2.8(A17)
A18: SK2.7(A18)
A19: SK2.6(A19)
A20: SK2.5(A20)
A21: SK2.4(A21)
A22: SK2.3(A22)
A23: SK2.2(A23)
A24: SK2.1(A24)
A25: SK2.68(A25)
CLK2: SK2.67(CLK)
D0: RN211.6
D1: RN211.5
D2: RN211.7
D3: RN211.8
D4: RN212.5
D5: RN212.6
D6: RN212.7
D7: RN212.8
D8: RN214.8
D9: RN214.7
D10: RN214.5
D11: RN214.6
D12: RN213.5
D13: RN213.6
D14: RN213.7
D15: RN213.8
D16: RN221.5
D17: RN221.6
D18: RN221.8
D19: RN221.7
D20: RN222.8
D21: RN222.7
D22: RN222.5
D23: RN222.6
D24: RN224.7
D25: RN224.6
D26: RN224.8
D27: RN224.5
D28: RN223.6
D29: RN223.8
D30: RN223.7
D31: RN223.5
M2ABRT: SK2.53(ABRT)
M2DBE: SK2.56(DBE)
M2nCAS0: SK2.39(nCAS0) U21.31(LCAS)
M2nCAS1: SK2.40(nCAS1) U21.30(UCAS)
M2nCAS2: SK2.41(nCAS2) U22.31(LCAS)
M2nCAS3: SK2.42(nCAS3) U22.30(UCAS)
M2nRAS: SK2.38(nRAS) U21.14(RAS) U22.14(RAS)
M2OE: U21.29(OE) U22.29(OE)
M2RA0: SK2.28(RA0) U21.17(A0) U22.17(A0)
M2RA1: SK2.29(RA1) U21.18(A1) U22.18(A1)
M2RA2: SK2.30(RA2) U21.19(A2) U22.19(A2)
M2RA3: SK2.31(RA3) U21.20(A3) U22.20(A3)
M2RA4: SK2.32(RA4) U21.23(A4) U22.23(A4)
M2RA5: SK2.33(RA5) U21.24(A5) U22.24(A5)
M2RA6: SK2.34(RA6) U21.25(A6) U22.25(A6)
M2RA7: SK2.35(RA7) U21.26(A7) U22.26(A7)
M2RA8: SK2.36(RA8) U21.27(A8) U22.27(A8)
M2RA9: SK2.37(RA9) U21.28(A9) U22.28(A9)
M2WE: U21.13(WE) U22.13(WE)
MFLBK: SK2.45(FLBK)
MnBW: SK2.63(nBW)
MnSDRQ: SK2.47(nSDRQ)
MnVDRQ: SK2.48(nVDRQ)
MRST: SK2.44(RES)
nHSYC: SK2.46(nHSYC)
nIOGT: SK2.58(nIOGT)
nMREQ: SK2.55(nMREQ)
nRW: SK2.62(nRW)
REF2: SK2.64(RCLK)
SEQ: SK2.54(SEQ)
SPMD: SK2.52(SPMD)
NetRN211_1: RN211.1 U21.5(DQ3)
NetRN211_2: RN211.2 U21.4(DQ2)
NetRN211_3: RN211.3 U21.3(DQ1)
NetRN211_4: RN211.4 U21.2(DQ0)
NetRN212_1: RN212.1 U21.10(DQ7)
NetRN212_2: RN212.2 U21.9(DQ6)
NetRN212_3: RN212.3 U21.8(DQ5)
NetRN212_4: RN212.4 U21.7(DQ4)
NetRN213_1: RN213.1 U21.36(DQ11)
NetRN213_2: RN213.2 U21.35(DQ10)
NetRN213_3: RN213.3 U21.34(DQ9)
NetRN213_4: RN213.4 U21.33(DQ8)
NetRN214_1: RN214.1 U21.38(DQ12)
NetRN214_2: RN214.2 U21.39(DQ13)
NetRN214_3: RN214.3 U21.40(DQ14)
NetRN214_4: RN214.4 U21.41(DQ15)
NetRN221_1: RN221.1 U22.5(DQ3)
NetRN221_2: RN221.2 U22.4(DQ2)
NetRN221_3: RN221.3 U22.3(DQ1)
NetRN221_4: RN221.4 U22.2(DQ0)
NetRN222_1: RN222.1 U22.10(DQ7)
NetRN222_2: RN222.2 U22.9(DQ6)
NetRN222_3: RN222.3 U22.8(DQ5)
NetRN222_4: RN222.4 U22.7(DQ4)
NetRN223_1: RN223.1 U22.33(DQ8)
NetRN223_2: RN223.2 U22.34(DQ9)
NetRN223_3: RN223.3 U22.35(DQ10)
NetRN223_4: RN223.4 U22.36(DQ11)
NetRN224_1: RN224.1 U22.38(DQ12)
NetRN224_2: RN224.2 U22.39(DQ13)
NetRN224_3: RN224.3 U22.40(DQ14)
NetRN224_4: RN224.4 U22.41(DQ15)

Not connected (* = marked no-connect by the designer): SK2 49(nSDAK)* 50(nVDAK)* 51(nVIDW)* 57(nSIRQ)* 59(nIORQ)* 60(nRMCS)* 65(phi2)* 66(phi1)*; U21 15(A11)* 16(A10)*; U22 15(A11)* 16(A10)*

### Notes on the sheet
- SIZE
- CODION LTD
- DIMENSIONS
- TITLE
- VARIANT
- REVISION
- DATE
- A3
- SHEET
- OF
- FILE
- DRAWN BY

### Library data of the parts
C21-C28 = 100nF0805: as C1 on sheet A3000_8MB; Datasheet Link: https://product.tdk.com/info/en/catalog/datasheets/mlcc_commercial_midvoltage_en.pdf; Height: 1.45mm; Mouser Part Number: 810-C2012X7R1H104KT5; Mouser Price/Stock: https://www.mouser.com/Search/Refine.aspx?Keyword=810-C2012X7R1H104KT5; Arrow Part Number: C2012X7R1H104K125AM; Arrow Price/Stock: https://www.arrow.com/en/products/c2012x7r1h104k125am/tdk; LCSC Part #: C111492
RN211-RN214 RN221-RN224 = YC164-JR-0768RL: as RN111 on sheet A3000_8MB; Datasheet Link: https://www.yageo.com/upload/media/product/productsearch/datasheet/rchip/PYu-YC_TC_group_51_RoHS_L_9.pdf; Height: 0.7mm; Manufacturer_Part_Number: YC164-JR-0768RL; Mouser Part Number: 603-YC164-JR-0768RL; Mouser Price/Stock: https://www.mouser.co.uk/ProductDetail/Yageo/YC164-JR-0768RL?qs=8cPjvKtxWv7AOp%2F0jDxI3w%3D%3D; Arrow Part Number: YC164-JR-0768RL; Arrow Price/Stock: https://www.arrow.com/en/products/yc164-jr-0768rl/yageo; LCSC Part #: C695188
SK2 = MEMC_Skt: as SK1 on sheet A3000_8MB; Datasheet Link: https://www.arrow.com/en/products/8468-21b1-rk-tr/3m; Height: 4.6mm; Mouser Part Number: 517-8468-21B1-RK-TR; Mouser Price/Stock: https://www.mouser.co.uk/ProductDetail/3M-Electronic-Solutions-Division/8468-21B1-RK-TR?qs=X%2F%2F06fXhnJ18zOj3KK47CQ%3D%3D; Arrow Part Number: 8468-21B1-RK-TR; Arrow Price/Stock: https://www.arrow.com/en/products/8468-21b1-rk-tr/3m
U21 U22 = DRAM_1MX16_SOJ: Value: IS41C16105C

## Nets that join several sheets
GND: A3000_8MB_Glue (11 pins), A3000_8MB (34 pins), A3000_8MB_Slave (16 pins)
VCC: A3000_8MB_Glue (33 pins), A3000_8MB (36 pins), A3000_8MB_Slave (16 pins)
A0: A3000_8MB (PL1.26 SK1.26), A3000_8MB_Slave (SK2.26)
A1: A3000_8MB (PL1.25 SK1.25), A3000_8MB_Slave (SK2.25)
A2: A3000_8MB (PL1.24 SK1.24), A3000_8MB_Slave (SK2.24)
A3: A3000_8MB (PL1.23 SK1.23), A3000_8MB_Slave (SK2.23)
A4: A3000_8MB (PL1.22 SK1.22), A3000_8MB_Slave (SK2.22)
A5: A3000_8MB (PL1.21 SK1.21), A3000_8MB_Slave (SK2.21)
A6: A3000_8MB (PL1.20 SK1.20), A3000_8MB_Slave (SK2.20)
A7: A3000_8MB (PL1.19 SK1.19), A3000_8MB_Slave (SK2.19)
A8: A3000_8MB (PL1.18 SK1.18), A3000_8MB_Slave (SK2.18)
A9: A3000_8MB (PL1.17 SK1.17), A3000_8MB_Slave (SK2.17)
A10: A3000_8MB (PL1.16 SK1.16), A3000_8MB_Slave (SK2.16)
A11: A3000_8MB (PL1.15 SK1.15), A3000_8MB_Slave (SK2.15)
A12: A3000_8MB (PL1.14 SK1.14), A3000_8MB_Slave (SK2.14)
A13: A3000_8MB (PL1.13 SK1.13), A3000_8MB_Slave (SK2.13)
A14: A3000_8MB (PL1.12 SK1.12), A3000_8MB_Slave (SK2.12)
A15: A3000_8MB (PL1.11 SK1.11), A3000_8MB_Slave (SK2.11)
A16: A3000_8MB (PL1.10 SK1.10), A3000_8MB_Slave (SK2.10)
A17: A3000_8MB (PL1.8 SK1.8), A3000_8MB_Slave (SK2.8)
A18: A3000_8MB (PL1.7 SK1.7), A3000_8MB_Slave (SK2.7)
A19: A3000_8MB (PL1.6 SK1.6), A3000_8MB_Slave (SK2.6)
A20: A3000_8MB (PL1.5 SK1.5), A3000_8MB_Slave (SK2.5)
A21: A3000_8MB (PL1.4 SK1.4), A3000_8MB_Slave (SK2.4)
A22: A3000_8MB (PL1.3 SK1.3), A3000_8MB_Slave (SK2.3)
A23: A3000_8MB (PL1.2 SK1.2), A3000_8MB_Slave (SK2.2)
A24: A3000_8MB (PL1.1 SK1.1), A3000_8MB_Slave (SK2.1)
A25: A3000_8MB (PL1.68 SK1.68), A3000_8MB_Slave (SK2.68)
ABRT: A3000_8MB_Glue (IC53.3), A3000_8MB (PL1.53)
CLK: A3000_8MB_Glue (IC59.2 IC59.5 IC71.1), A3000_8MB (PL1.67)
CLK1: A3000_8MB_Glue (R519.1), A3000_8MB (SK1.67)
CLK2: A3000_8MB_Glue (R520.1), A3000_8MB_Slave (SK2.67)
D0: A3000_8MB (J1.3 RN111.5), A3000_8MB_Slave (RN211.6)
D1: A3000_8MB (J1.2 RN111.6), A3000_8MB_Slave (RN211.5)
D2: A3000_8MB (J1.19 RN111.8), A3000_8MB_Slave (RN211.7)
D3: A3000_8MB (J1.17 RN111.7), A3000_8MB_Slave (RN211.8)
D4: A3000_8MB (J1.20 RN112.5), A3000_8MB_Slave (RN212.5)
D5: A3000_8MB (J2.1 RN112.6), A3000_8MB_Slave (RN212.6)
D6: A3000_8MB (J2.3 RN112.8), A3000_8MB_Slave (RN212.7)
D7: A3000_8MB (J2.2 RN112.7), A3000_8MB_Slave (RN212.8)
D8: A3000_8MB (J2.5 RN114.5), A3000_8MB_Slave (RN214.8)
D9: A3000_8MB (J2.6 RN114.6), A3000_8MB_Slave (RN214.7)
D10: A3000_8MB (J2.8 RN114.8), A3000_8MB_Slave (RN214.5)
D11: A3000_8MB (J2.7 RN114.7), A3000_8MB_Slave (RN214.6)
D12: A3000_8MB (J2.9 RN113.5), A3000_8MB_Slave (RN213.5)
D13: A3000_8MB (J2.10 RN113.6), A3000_8MB_Slave (RN213.6)
D14: A3000_8MB (J2.12 RN113.8), A3000_8MB_Slave (RN213.7)
D15: A3000_8MB (J2.11 RN113.7), A3000_8MB_Slave (RN213.8)
D16: A3000_8MB (J2.15 RN121.5), A3000_8MB_Slave (RN221.5)
D17: A3000_8MB (J2.17 RN121.6), A3000_8MB_Slave (RN221.6)
D18: A3000_8MB (J2.19 RN121.8), A3000_8MB_Slave (RN221.8)
D19: A3000_8MB (J2.18 RN121.7), A3000_8MB_Slave (RN221.7)
D20: A3000_8MB (J3.1 RN122.5), A3000_8MB_Slave (RN222.8)
D21: A3000_8MB (J3.3 RN122.6), A3000_8MB_Slave (RN222.7)
D22: A3000_8MB (J3.15 RN122.8), A3000_8MB_Slave (RN222.5)
D23: A3000_8MB (J3.5 RN122.7), A3000_8MB_Slave (RN222.6)
D24: A3000_8MB (J3.12 RN124.6), A3000_8MB_Slave (RN224.7)
D25: A3000_8MB (J3.11 RN124.7), A3000_8MB_Slave (RN224.6)
D26: A3000_8MB (J3.13 RN124.5), A3000_8MB_Slave (RN224.8)
D27: A3000_8MB (J1.15 RN124.8), A3000_8MB_Slave (RN224.5)
D28: A3000_8MB (J3.18 RN123.7), A3000_8MB_Slave (RN223.6)
D29: A3000_8MB (J3.16 RN123.5), A3000_8MB_Slave (RN223.8)
D30: A3000_8MB (J3.17 RN123.6), A3000_8MB_Slave (RN223.7)
D31: A3000_8MB (J3.19 RN123.8), A3000_8MB_Slave (RN223.5)
FLBK: A3000_8MB_Glue (IC4.6), A3000_8MB (PL1.45)
M1ABRT: A3000_8MB_Glue (IC53.1), A3000_8MB (SK1.53)
M1DBE: A3000_8MB_Glue (IC1.1 IC1.3), A3000_8MB (PL1.56 SK1.56)
M1OE: A3000_8MB_Glue (IC1.6), A3000_8MB (U1.29 U2.29)
M1WE: A3000_8MB_Glue (IC1.2), A3000_8MB (U1.13 U2.13)
M2ABRT: A3000_8MB_Glue (IC53.2 R532.1), A3000_8MB_Slave (SK2.53)
M2DBE: A3000_8MB_Glue (IC1.11 IC1.13), A3000_8MB_Slave (SK2.56)
M2OE: A3000_8MB_Glue (IC1.8), A3000_8MB_Slave (U21.29 U22.29)
M2WE: A3000_8MB_Glue (IC1.12), A3000_8MB_Slave (U21.13 U22.13)
MFLBK: A3000_8MB_Glue (IC4.7), A3000_8MB (SK1.45), A3000_8MB_Slave (SK2.45)
MnBW: A3000_8MB_Glue (R514.1), A3000_8MB_Slave (SK2.63)
MnSDRQ: A3000_8MB_Glue (IC4.5), A3000_8MB (SK1.47), A3000_8MB_Slave (SK2.47)
MnVDRQ: A3000_8MB_Glue (IC4.2), A3000_8MB (SK1.48), A3000_8MB_Slave (SK2.48)
MRST: A3000_8MB_Glue (IC52.1 R7.2 R8.1), A3000_8MB (R6.2 SK1.44), A3000_8MB_Slave (SK2.44)
nBW: A3000_8MB_Glue (IC53.5), A3000_8MB (PL1.63 SK1.63)
nHSYC: A3000_8MB (PL1.46 SK1.46), A3000_8MB_Slave (SK2.46)
nIOGT: A3000_8MB (PL1.58 SK1.58), A3000_8MB_Slave (SK2.58)
nMREQ: A3000_8MB (PL1.55 SK1.55), A3000_8MB_Slave (SK2.55)
nRW: A3000_8MB (PL1.62 SK1.62), A3000_8MB_Slave (SK2.62)
nSDRQ: A3000_8MB_Glue (IC4.4), A3000_8MB (PL1.47)
nVDRQ: A3000_8MB_Glue (IC4.3), A3000_8MB (PL1.48)
RCLK: A3000_8MB_Glue (R523.2), A3000_8MB (PL1.64 SK1.64)
REF2: A3000_8MB_Glue (IC71.3 R510.1), A3000_8MB_Slave (SK2.64)
SEQ: A3000_8MB (PL1.54 SK1.54), A3000_8MB_Slave (SK2.54)
SPMD: A3000_8MB (PL1.52 SK1.52), A3000_8MB_Slave (SK2.52)

## Assembly variants
JLCPCB_Assy: not fitted C1 C2 C3 C4 C7 C8 C13 C14 C15 C21 C22 C23 C24 C27 C28 C101 D1 IC4 IC71 PL1 R6 R9 R552 R561 RST_IN SK1 SK2 U1 U2 U21 U22